# Altium schematic sheet 2015-04-12_03-12-171.schdoc
size 217 x 195 mm; SheetNumber: 1; SheetTotal: 1
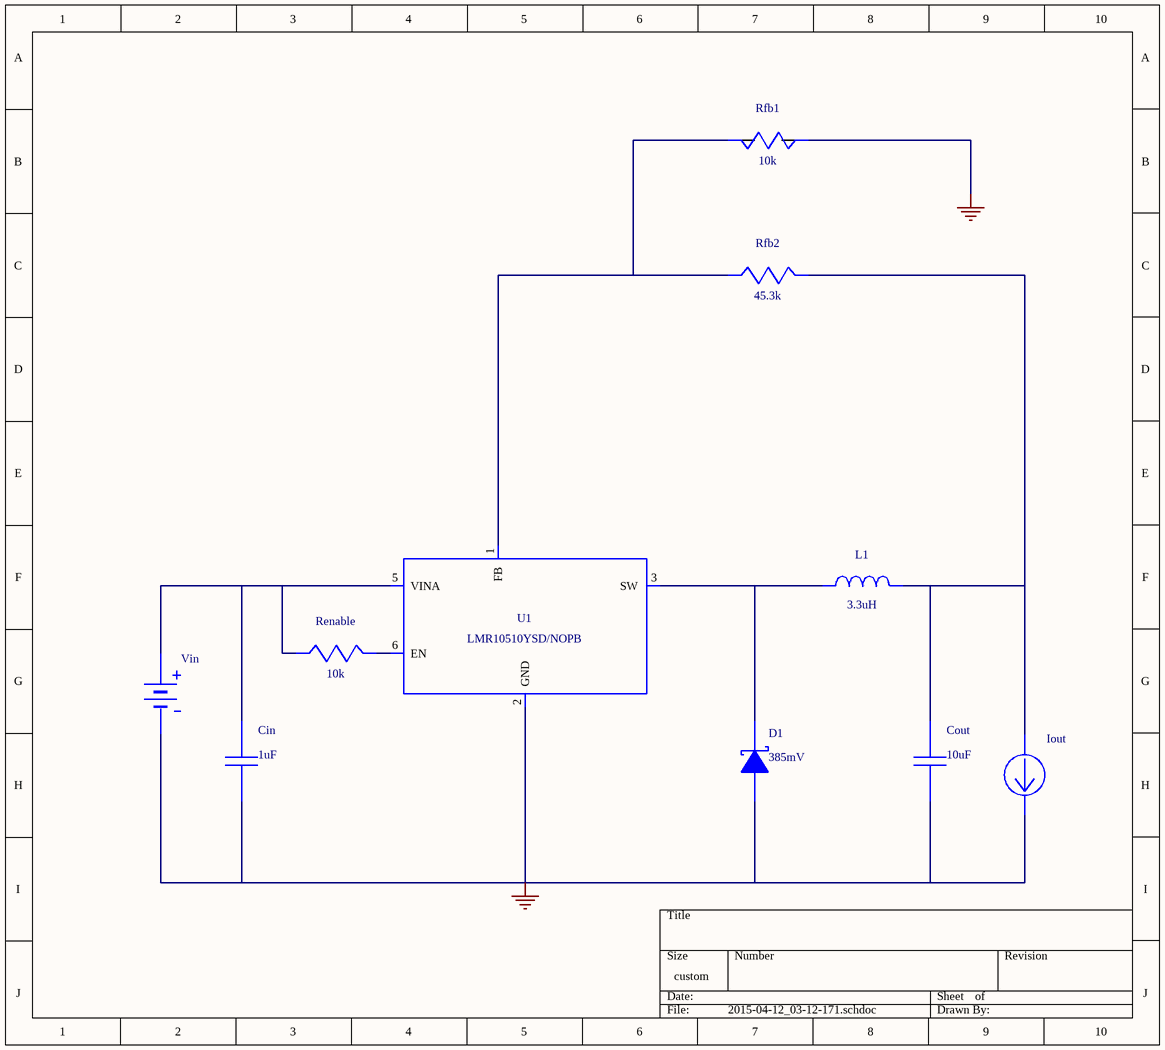
[diagram p0: 2015-04-12_03-12-171.schdoc]

## Parts
Cin  value 1uF  (hidden comment: GRM188R71C105KA12D)
Cout  value 10uF  (hidden comment: GRM188R60J106ME47D)
D1  value 385mV  (hidden comment: MBR0520LT1G)
Iout  WB_CURRENT_LOAD  (value not drawn)
L1  value 3.3uH  (hidden comment: ME3220-332MLB)
Renable  value 10k  (hidden comment: CRCW040210K0FKED)
Rfb1  value 10k  (hidden comment: CRCW040210K0FKED)
Rfb2  value 45.3k  (hidden comment: CRCW040245K3FKED)
U1  LMR10510YSD/NOPB
Vin  WB_BATTERY  (value not drawn)

## Nets
0: Cin.2 Cout.2 D1.2(A) Iout.2(-) U1.2(GND) U1.7(DAP) Vin.2(-)
NetCin_1: Cin.1 Renable.2 U1.4(VIND) U1.5(VINA) Vin.1(+)
NetCout_1: Cout.1 Iout.1(+) L1.2 Rfb2.1
NetD1_1: D1.1(K) L1.1 U1.3(SW)
NetRenable_1: Renable.1 U1.6(EN)
NetRfb2_2: Rfb2.2 U1.1(FB)

Not connected (* = marked no-connect by the designer): Rfb1 1 2

## Library data of the parts
Cin = GRM188R71C105KA12D: GRM188R71C105KA1; Manufacturer Name: MuRata; PackageReference: GRM188R71C105KA12D; Manufacturer Part Number: GRM188R71C105KA12D
Cout = GRM188R60J106ME47D: GRM188R60J106ME4; Manufacturer Name: MuRata; PackageReference: GRM188R60J106ME47D; Manufacturer Part Number: GRM188R60J106ME47D
D1 = MBR0520LT1G: Manufacturer Name: ON Semiconductor; PackageReference: MBR0520LT1G; Manufacturer Part Number: MBR0520LT1G
Iout = WB_CURRENT_LOAD: Value: UNLISTED; PackageReference: WB_CURRENT_LOAD; Manufacturer Part Number: WB_CURRENT_LOAD; Manufacturer Name: WB_CURRENT_LOAD
L1 = ME3220-332MLB: Manufacturer Name: Coilcraft; PackageReference: ME3220-332MLB; Manufacturer Part Number: ME3220-332MLB
Renable Rfb1 = CRCW040210K0FKED: Manufacturer Name: Vishay-Dale; PackageReference: CRCW040210K0FKED; Manufacturer Part Number: CRCW040210K0FKED
Rfb2 = CRCW040245K3FKED: Manufacturer Name: Vishay-Dale; PackageReference: CRCW040245K3FKED; Manufacturer Part Number: CRCW040245K3FKED
U1 = LMR10510YSD/NOPB: Manufacturer Name: Texas Instruments; PackageReference: LMR10510YSD/NOPB; Manufacturer Part Number: LMR10510YSD/NOPB; Value: Value
Vin = WB_BATTERY: Value: UNLISTED; PackageReference: WB_BATTERY; Manufacturer Part Number: WB_BATTERY; Manufacturer Name: WB_BATTERY